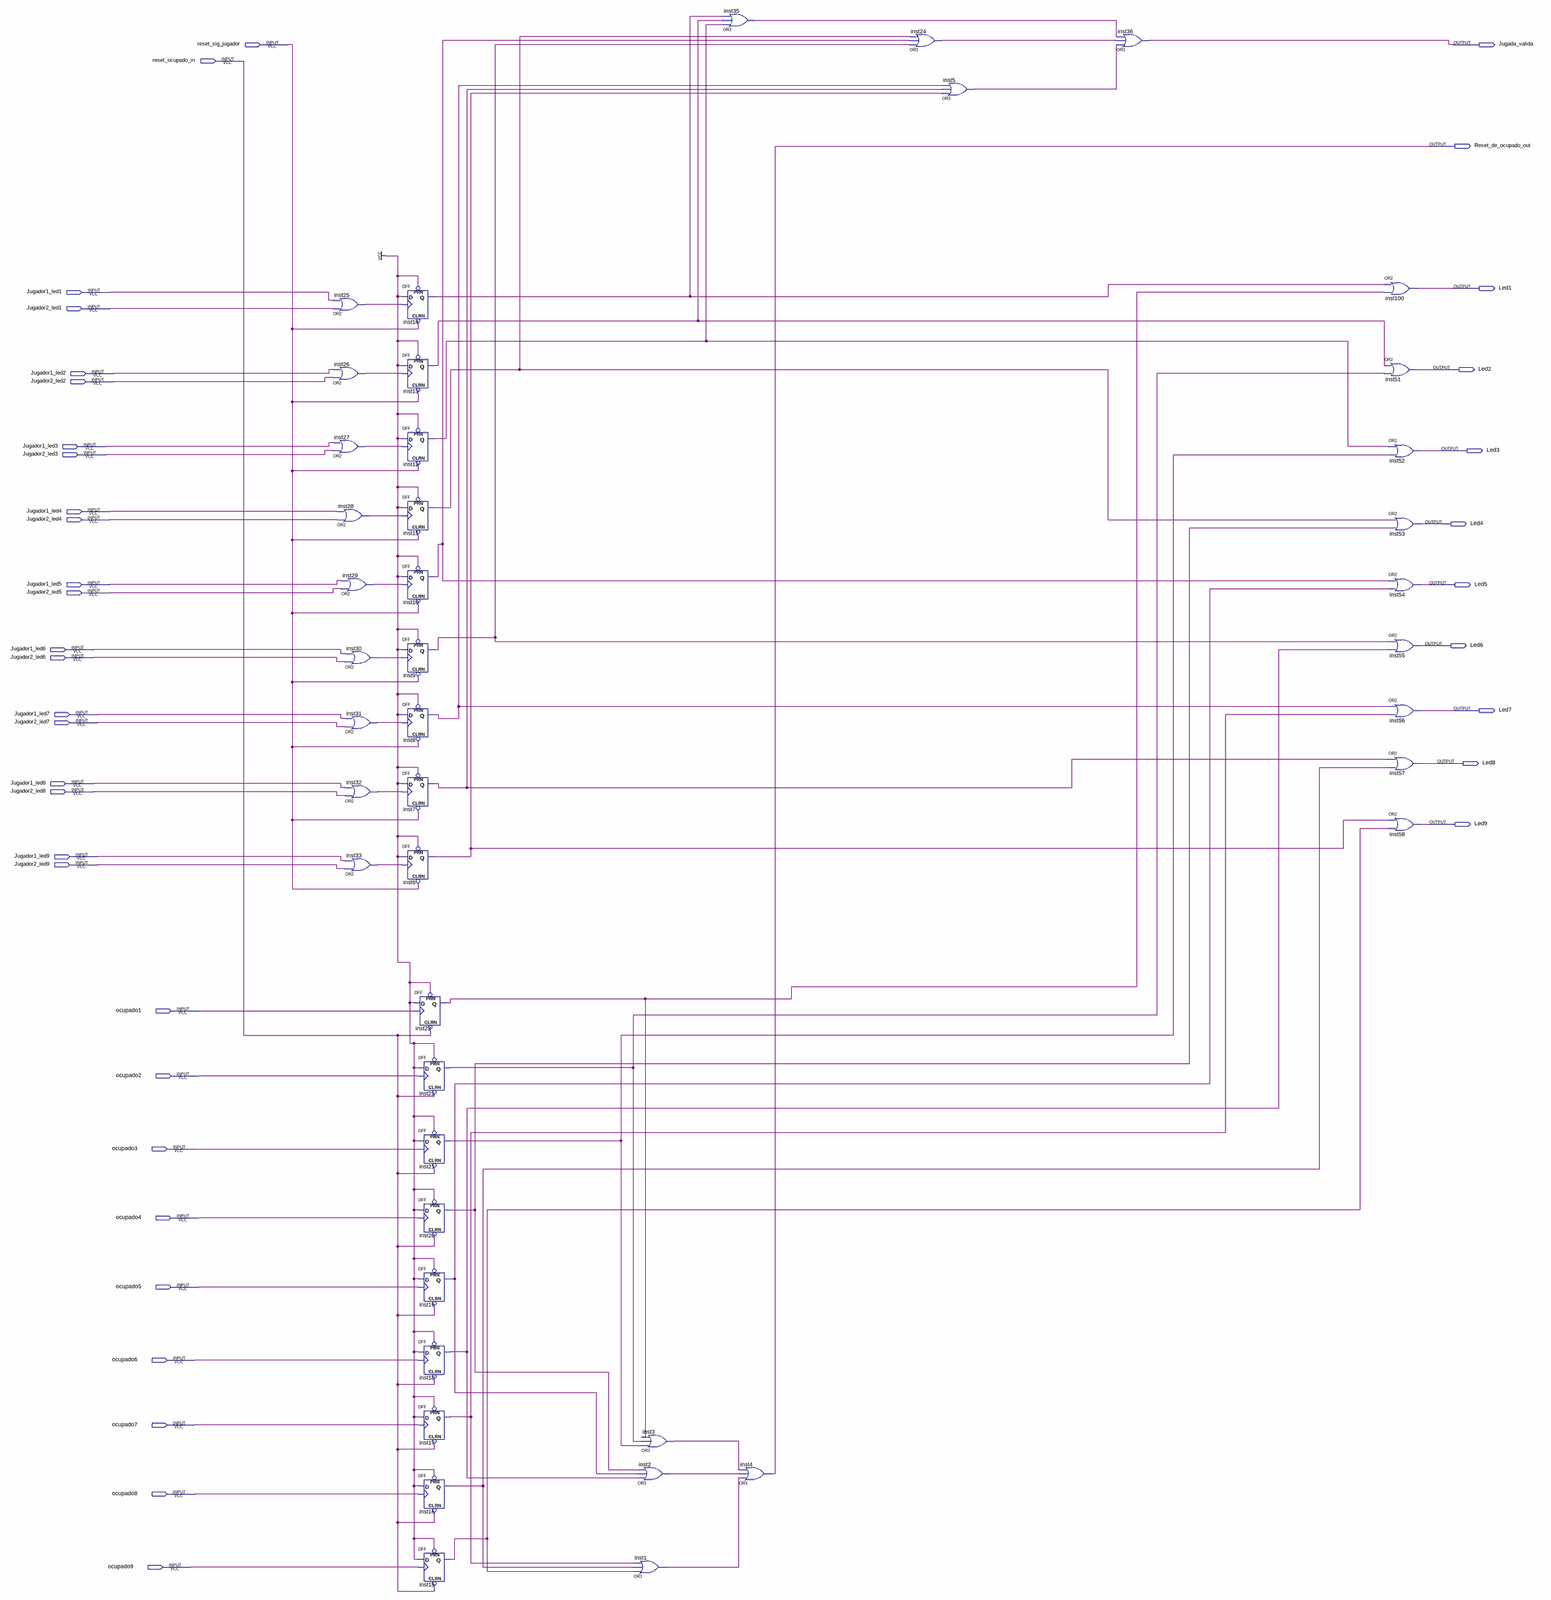
[diagram p0: schematic sheet, whole]
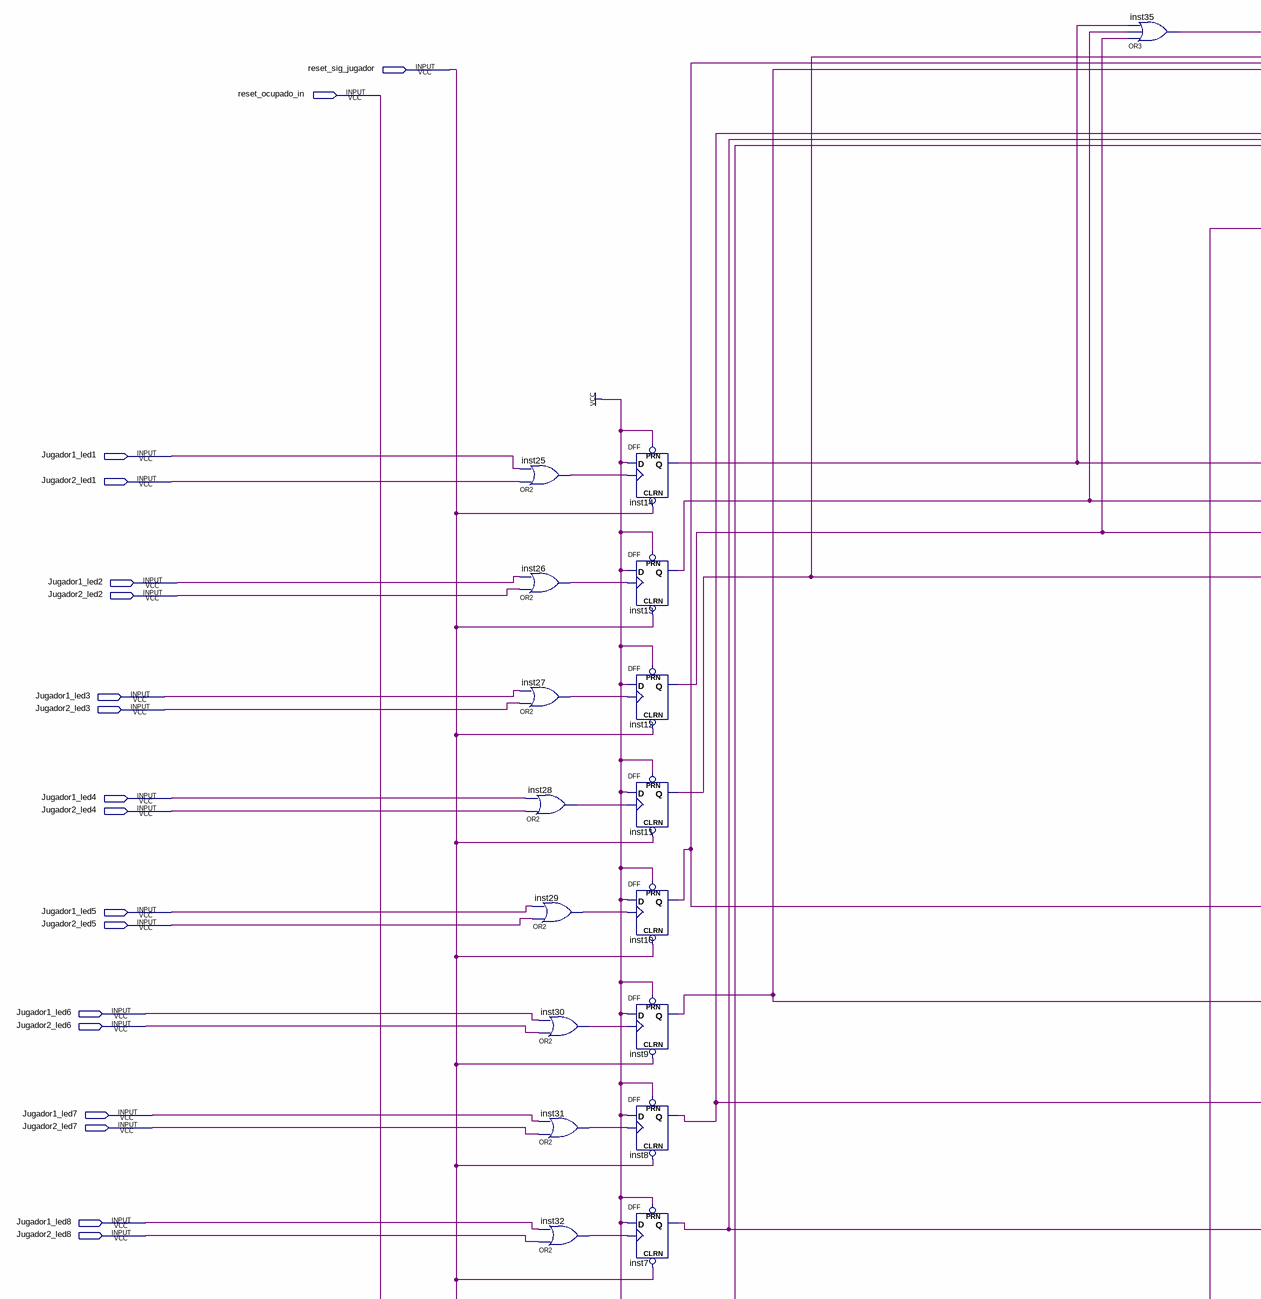
[diagram p1: schematic sheet, upper left part]
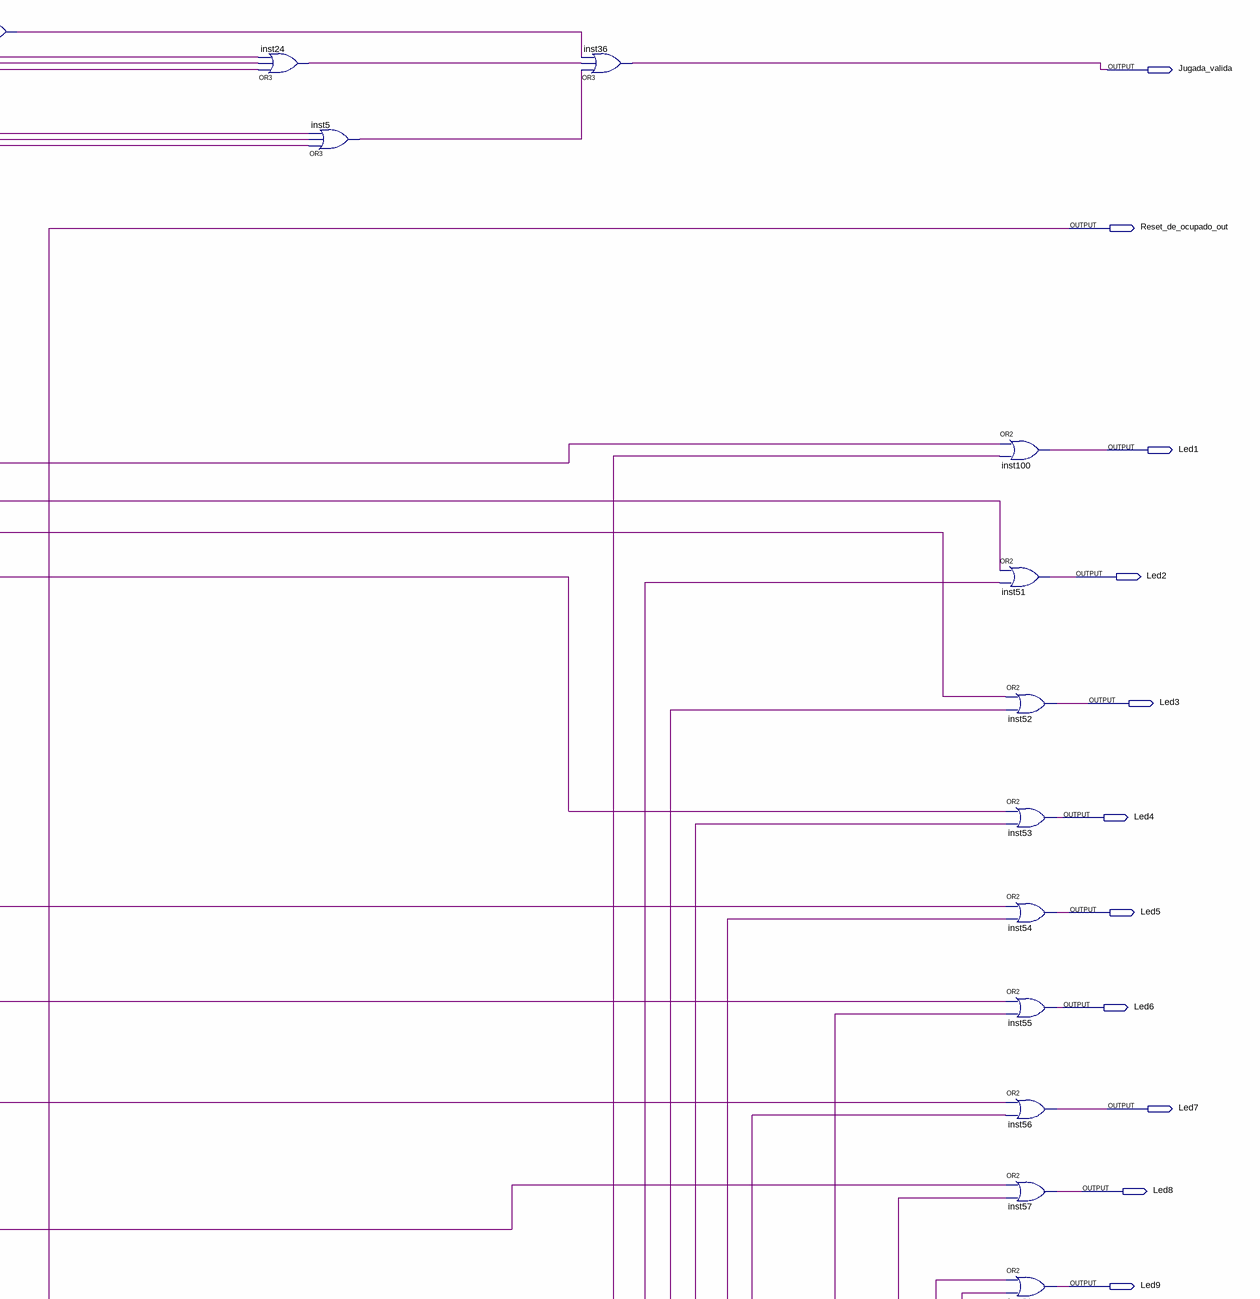
[diagram p2: schematic sheet, upper right part]
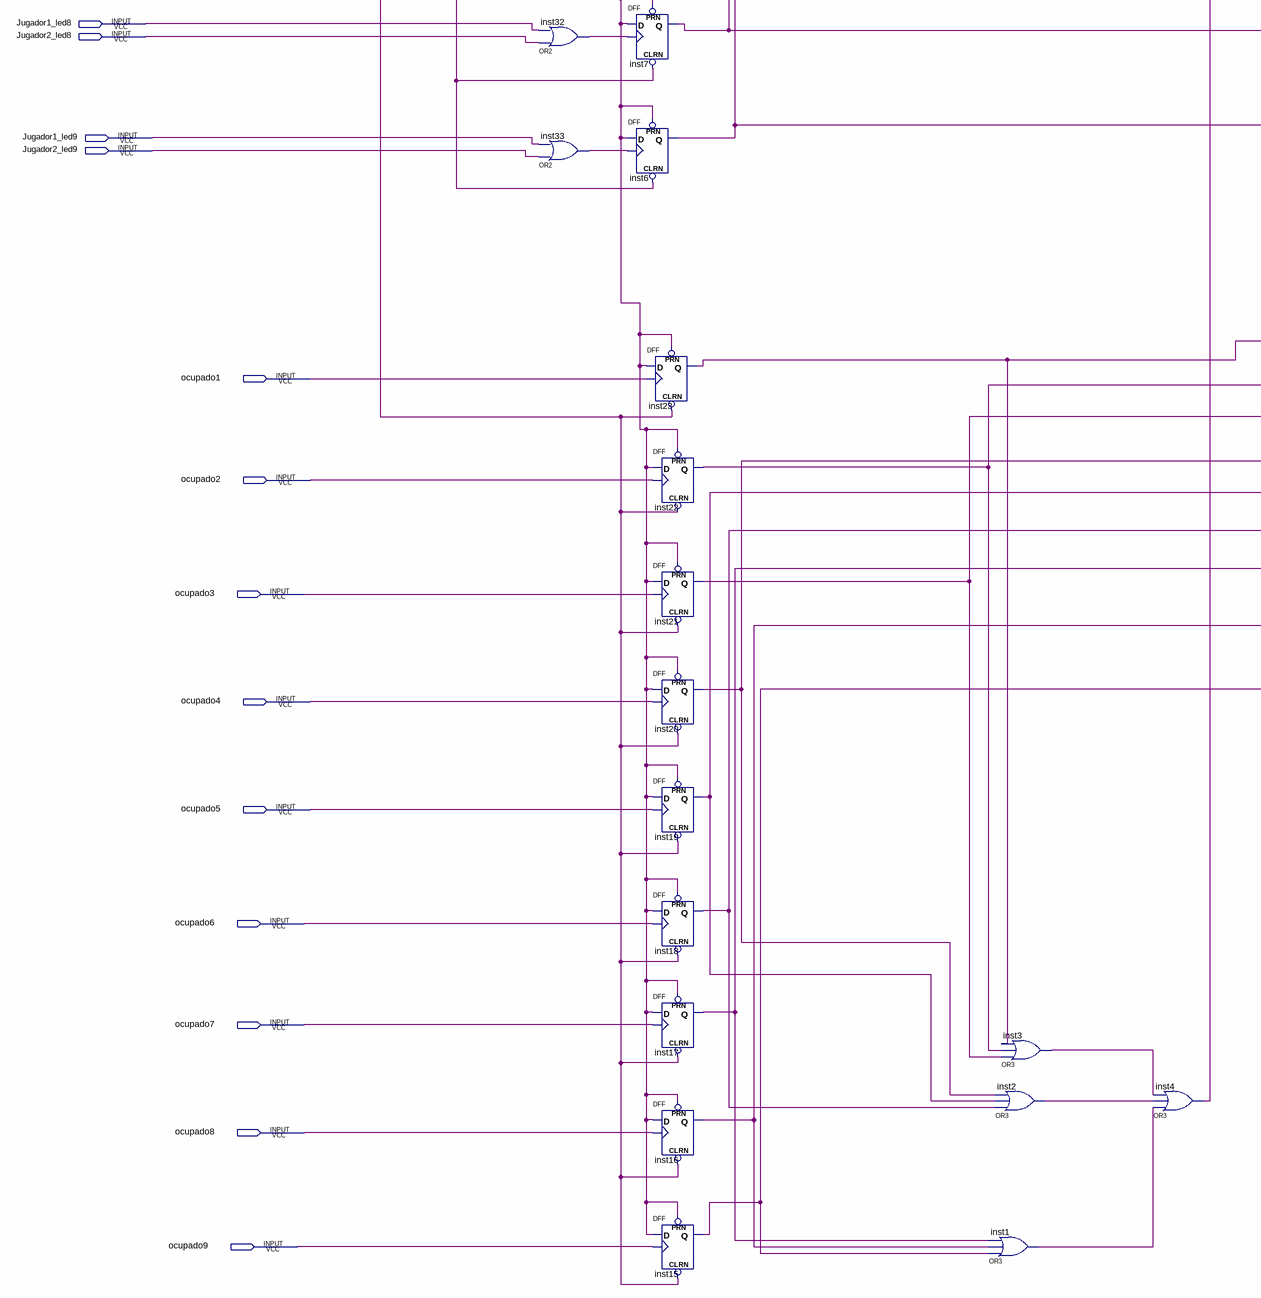
[diagram p3: schematic sheet, lower left part]
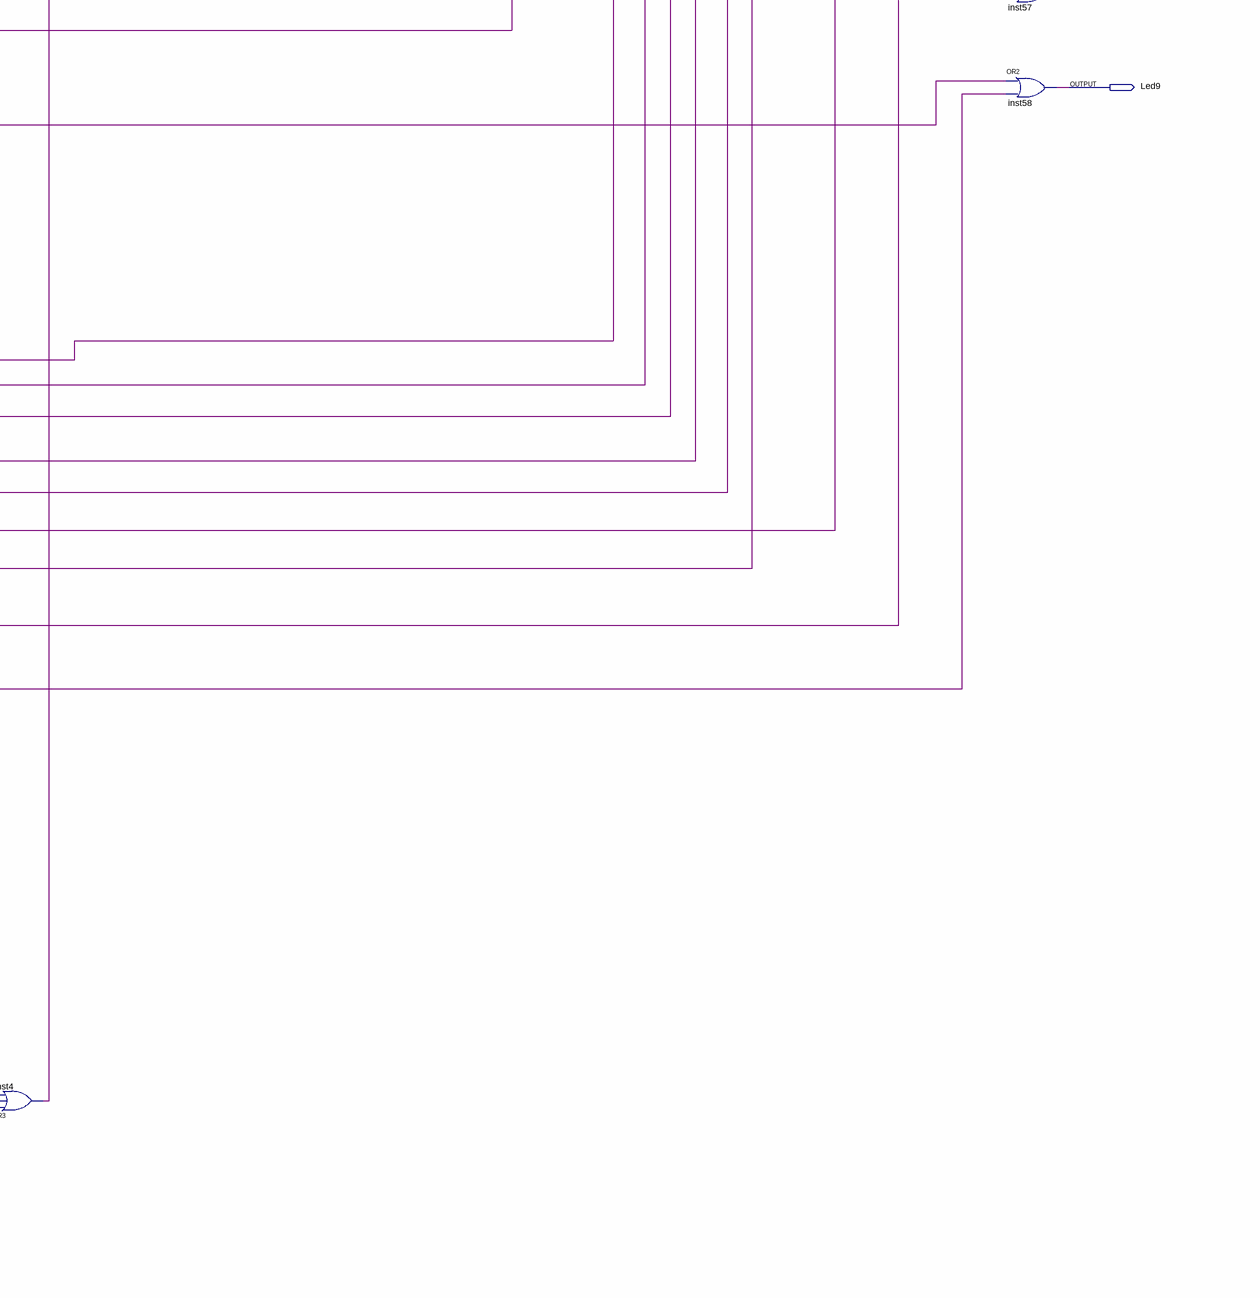
[diagram p4: schematic sheet, lower right part]
// Quartus schematic leds.bdf as structural Verilog: 44 symbols, 40 pins
module leds (
  input  reset_sig_jugador,
  input  reset_ocupado_in,
  input  Jugador1_led1,
  input  Jugador2_led1,
  input  Jugador1_led2,
  input  Jugador2_led2,
  input  Jugador1_led3,
  input  Jugador2_led3,
  input  Jugador1_led4,
  input  Jugador2_led4,
  input  Jugador1_led5,
  input  Jugador2_led5,
  input  Jugador1_led6,
  input  Jugador2_led6,
  input  Jugador1_led7,
  input  Jugador2_led7,
  input  Jugador1_led8,
  input  Jugador2_led8,
  input  Jugador1_led9,
  input  Jugador2_led9,
  input  ocupado1,
  input  ocupado2,
  input  ocupado3,
  input  ocupado4,
  input  ocupado5,
  input  ocupado6,
  input  ocupado7,
  input  ocupado8,
  input  ocupado9,
  output Jugada_valida,
  output Reset_de_ocupado_out,
  output Led1,
  output Led2,
  output Led3,
  output Led4,
  output Led5,
  output Led6,
  output Led7,
  output Led8,
  output Led9
);

  wire inst1_out, inst2_out, inst3_out, inst5_out, inst6_q, inst7_q, inst8_q, inst9_q, inst10_q, inst11_q,
       inst12_q, inst13_q, inst14_q, inst15_q, inst16_q, inst17_q, inst18_q, inst19_q, inst20_q, inst21_q,
       inst22_q, inst23_q, inst24_out, inst25_out, inst26_out, inst27_out, inst28_out, inst29_out,
       inst30_out, inst31_out, inst32_out, inst33_out, inst35_out;

  or inst25 (inst25_out, Jugador2_led1, Jugador1_led1);
  or inst26 (inst26_out, Jugador2_led2, Jugador1_led2);
  or inst27 (inst27_out, Jugador2_led3, Jugador1_led3);
  or inst28 (inst28_out, Jugador2_led4, Jugador1_led4);
  or inst29 (inst29_out, Jugador2_led5, Jugador1_led5);
  or inst30 (inst30_out, Jugador2_led6, Jugador1_led6);
  or inst31 (inst31_out, Jugador2_led7, Jugador1_led7);
  or inst32 (inst32_out, Jugador2_led8, Jugador1_led8);
  or inst33 (inst33_out, Jugador2_led9, Jugador1_led9);
  DFF inst14 (.CLRN(reset_sig_jugador), .CLK(inst25_out), .D(1'b1), .PRN(1'b1), .Q(inst14_q));
  DFF inst13 (.CLRN(reset_sig_jugador), .CLK(inst26_out), .D(1'b1), .PRN(1'b1), .Q(inst13_q));
  DFF inst12 (.CLRN(reset_sig_jugador), .CLK(inst27_out), .D(1'b1), .PRN(1'b1), .Q(inst12_q));
  DFF inst11 (.CLRN(reset_sig_jugador), .CLK(inst28_out), .D(1'b1), .PRN(1'b1), .Q(inst11_q));
  DFF inst10 (.CLRN(reset_sig_jugador), .CLK(inst29_out), .D(1'b1), .PRN(1'b1), .Q(inst10_q));
  DFF inst9 (.CLRN(reset_sig_jugador), .CLK(inst30_out), .D(1'b1), .PRN(1'b1), .Q(inst9_q));
  DFF inst8 (.CLRN(reset_sig_jugador), .CLK(inst31_out), .D(1'b1), .PRN(1'b1), .Q(inst8_q));
  DFF inst7 (.CLRN(reset_sig_jugador), .CLK(inst32_out), .D(1'b1), .PRN(1'b1), .Q(inst7_q));
  DFF inst6 (.CLRN(reset_sig_jugador), .CLK(inst33_out), .D(1'b1), .PRN(1'b1), .Q(inst6_q));
  DFF inst23 (.CLRN(reset_ocupado_in), .CLK(ocupado1), .D(1'b1), .PRN(1'b1), .Q(inst23_q));
  DFF inst22 (.CLRN(reset_ocupado_in), .CLK(ocupado2), .D(1'b1), .PRN(1'b1), .Q(inst22_q));
  DFF inst21 (.CLRN(reset_ocupado_in), .CLK(ocupado3), .D(1'b1), .PRN(1'b1), .Q(inst21_q));
  DFF inst20 (.CLRN(reset_ocupado_in), .CLK(ocupado4), .D(1'b1), .PRN(1'b1), .Q(inst20_q));
  DFF inst19 (.CLRN(reset_ocupado_in), .CLK(ocupado5), .D(1'b1), .PRN(1'b1), .Q(inst19_q));
  DFF inst18 (.CLRN(reset_ocupado_in), .CLK(ocupado6), .D(1'b1), .PRN(1'b1), .Q(inst18_q));
  DFF inst17 (.CLRN(reset_ocupado_in), .CLK(ocupado7), .D(1'b1), .PRN(1'b1), .Q(inst17_q));
  DFF inst16 (.CLRN(reset_ocupado_in), .CLK(ocupado8), .D(1'b1), .PRN(1'b1), .Q(inst16_q));
  DFF inst15 (.CLRN(reset_ocupado_in), .CLK(ocupado9), .D(1'b1), .PRN(1'b1), .Q(inst15_q));
  or inst3 (inst3_out, inst21_q, inst22_q, inst23_q);
  or inst2 (inst2_out, inst18_q, inst19_q, inst20_q);
  or inst1 (inst1_out, inst15_q, inst16_q, inst17_q);
  or inst35 (inst35_out, inst12_q, inst13_q, inst14_q);
  or inst4 (Reset_de_ocupado_out, inst1_out, inst2_out, inst3_out);
  or inst24 (inst24_out, inst9_q, inst10_q, inst11_q);
  or inst5 (inst5_out, inst6_q, inst7_q, inst8_q);
  or inst36 (Jugada_valida, inst5_out, inst24_out, inst35_out);
  or inst100 (Led1, inst14_q, inst23_q);
  or inst51 (Led2, inst13_q, inst22_q);
  or inst52 (Led3, inst12_q, inst21_q);
  or inst53 (Led4, inst11_q, inst20_q);
  or inst54 (Led5, inst10_q, inst19_q);
  or inst55 (Led6, inst9_q, inst18_q);
  or inst56 (Led7, inst8_q, inst17_q);
  or inst57 (Led8, inst7_q, inst16_q);
  or inst58 (Led9, inst6_q, inst15_q);
endmodule
